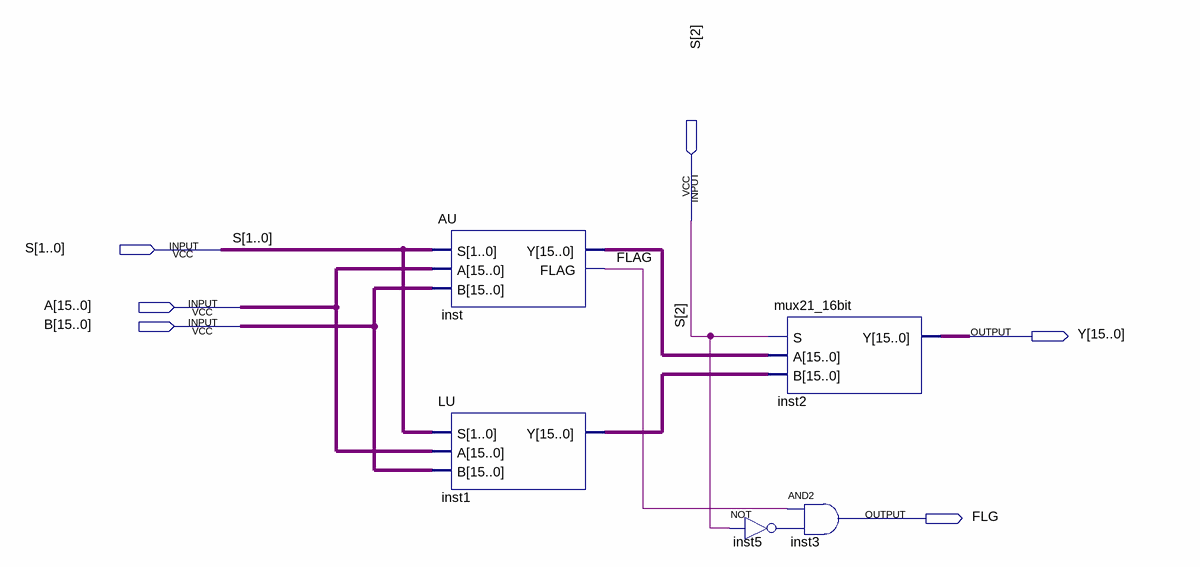
[diagram p0: schematic sheet]
// Quartus schematic ALU.bdf as structural Verilog: 5 symbols, 6 pins
module ALU (
  input  [2:0] S,
  input  [15:0] A,
  input  [15:0] B,
  output [15:0] Y,
  output FLG
);

  wire FLAG, inst5_out;
  wire [15:0] inst1_y, inst_y;

  AU inst (.S(S[1:0]), .A(A), .B(B), .Y(inst_y), .FLAG(FLAG));
  LU inst1 (.S(S[1:0]), .A(A), .B(B), .Y(inst1_y));
  mux21_16bit inst2 (.S(S[2]), .A(inst_y), .B(inst1_y), .Y(Y));
  not inst5 (inst5_out, S[2]);
  and inst3 (FLG, FLAG, inst5_out);
endmodule
